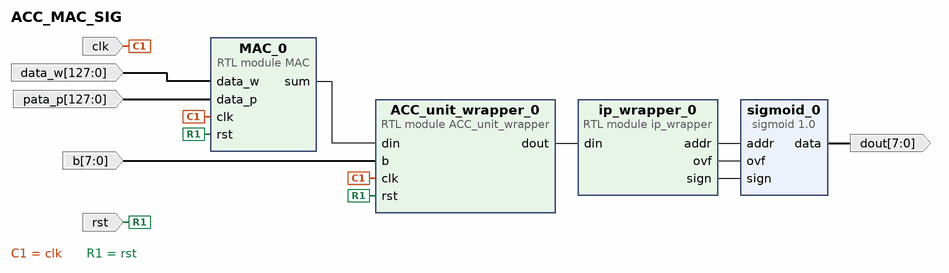
[diagram p0: block diagram of the top level]
# Vivado block design ACC_MAC_SIG, xc7a12tcpg238-3, Vivado 2023.2
create_bd_design ACC_MAC_SIG

create_bd_port -dir I -from 7 -to 0 b
create_bd_port -dir I clk
create_bd_port -dir I -from 127 -to 0 data_w
create_bd_port -dir I -from 127 -to 0 pata_p
create_bd_port -dir I rst
create_bd_port -dir O -from 7 -to 0 dout

create_bd_cell -type module -reference ACC_unit_wrapper ACC_unit_wrapper_0
create_bd_cell -type module -reference MAC MAC_0
create_bd_cell -type ip -vlnv siu.edu:user:sigmoid:1.0 sigmoid_0
create_bd_cell -type module -reference ip_wrapper ip_wrapper_0

# ---- connections ----

connect_bd_net [get_bd_pins ACC_unit_wrapper_0/dout] [get_bd_pins ip_wrapper_0/din]
connect_bd_net [get_bd_pins MAC_0/sum] [get_bd_pins ACC_unit_wrapper_0/din]
connect_bd_net [get_bd_ports clk] [get_bd_pins MAC_0/clk] [get_bd_pins ACC_unit_wrapper_0/clk]
connect_bd_net [get_bd_ports rst] [get_bd_pins MAC_0/rst] [get_bd_pins ACC_unit_wrapper_0/rst]
connect_bd_net [get_bd_ports b] [get_bd_pins ACC_unit_wrapper_0/b]
connect_bd_net [get_bd_ports data_w] [get_bd_pins MAC_0/data_w]
connect_bd_net [get_bd_pins ip_wrapper_0/addr] [get_bd_pins sigmoid_0/addr]
connect_bd_net [get_bd_pins ip_wrapper_0/ovf] [get_bd_pins sigmoid_0/ovf]
connect_bd_net [get_bd_pins ip_wrapper_0/sign] [get_bd_pins sigmoid_0/sign]
connect_bd_net [get_bd_ports pata_p] [get_bd_pins MAC_0/data_p]
connect_bd_net [get_bd_pins sigmoid_0/data] [get_bd_ports dout]

validate_bd_design
save_bd_design
